# Altium schematic sheet TxFrontendWaveyRadar.SchDoc: Tx Frontend WaveyRadar Schematic
size Letter; Author: Will Vu; CompanyName: Raccoon Wireless; DrawnBy: Will Vu, Raccoon Wireless; Engineer: Will Vu; Organization: Raccoon Wireless; DocumentNumber: 2-11; Revision: 2; SheetNumber: 11; SheetTotal: 15
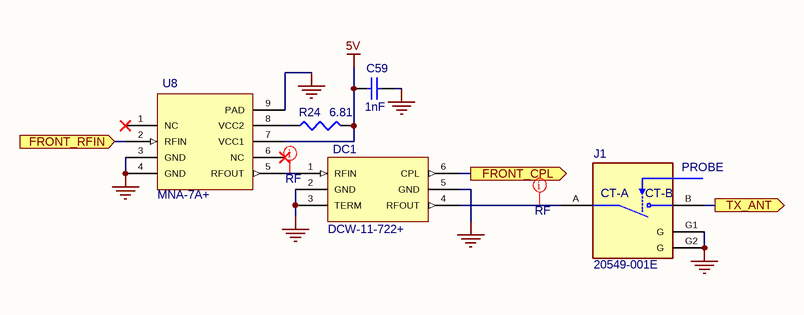
[diagram p0: TxFrontendWaveyRadar.SchDoc]

## Parts
C59  value 1nF  [CAPC0402(1005)33_L]  (hidden comment: Capacitor 1nF +/-20% 50V 0402)
DC1  DCW-11-722+  [DCW-11-722+-Footprint-1]
J1  20549-001E  [IPEX_20549-001E]
R24  value 6.81  [RESC1005X40X25NL05T05]  (hidden comment: CRCW04026R81FKED)
U8  MNA-7A+  [DQ849]

## Ports
FRONT_CPL (out), FRONT_RFIN (in), TX_ANT (out)

## Nets
5V: C59.2 R24.2 U8.7(VCC1)
GND: C59.1 DC1.2(GND) DC1.3(TERM) DC1.5(GND) J1.G1(G) J1.G2(G) U8.3(GND) U8.4(GND) U8.9(PAD)
FRONT_CPL: DC1.6(CPL) ; port FRONT_CPL
FRONT_RFIN: U8.2(RFIN) ; port FRONT_RFIN
TX_ANT: J1.B(CT-B) ; port TX_ANT
NetDC1_1: DC1.1(RFIN) U8.5(RFOUT)
NetDC1_4: DC1.4(RFOUT) J1.A(CT-A)
NetR24_1: R24.1 U8.8(VCC2)

Not connected (* = marked no-connect by the designer): U8 1(NC)* 6(NC)*

## Layout directives
net class RF: NetDC1_1, NetDC1_4

## Notes on the sheet
- /
- (in symbol CMP-044-000000-6) PROBE

## Library data of the parts
C59 = CMP-001-00066-4: Chip Capacitor, 1nF +/-20%, 50V, 0402, Thickness 0.33 mm; Tolerance: 10%; Case/Package: 0402; Max Operating Temperature: 85°C; Min Operating Temperature: -55°C; Mounting Technology: SMT; Voltage Rating: 50V; Pins: 2
DC1 = CMP-00025-00006-2: 50 ohm 11dB directional coupler 2.4 to 7.2 GHz; Impedance: 50 ohm; Coupling: 11dB
J1 = CMP-044-000000-6: 1 POS Vertical SMD Coaxial RF switch connector with a 2.3 x 2.3 mm footprint and support to 11 GHz, MHC; MF: I-PEX; Source: 20549-001E.SchLib; SnapEDA_Link: https://www.snapeda.com/parts/20549-001E/I-PEX/view-part/3220455/?ref=snap; Value: *; Design Item ID: 20549-001E; Package: None; Check_prices: https://www.snapeda.com/parts/20549-001E/I-PEX/view-part/3220455/?ref=eda; Price: None; Availability: Warning; MP: 20549-001E
R24 = CMP-009-00193-1: CRCW Series 0402 0.063 W 6.81 Ohm ±1 % ±100 ppm/K SMT Thick Film Chip Resistor
U8 = CMP-00025-00005-2: 50 ohm 1.5 to 6GHz 17.4db amplifier; Impedance: 50; Case Style: DQ849